# EAGLE design fpga_game_console (EAGLE 8.5.2)
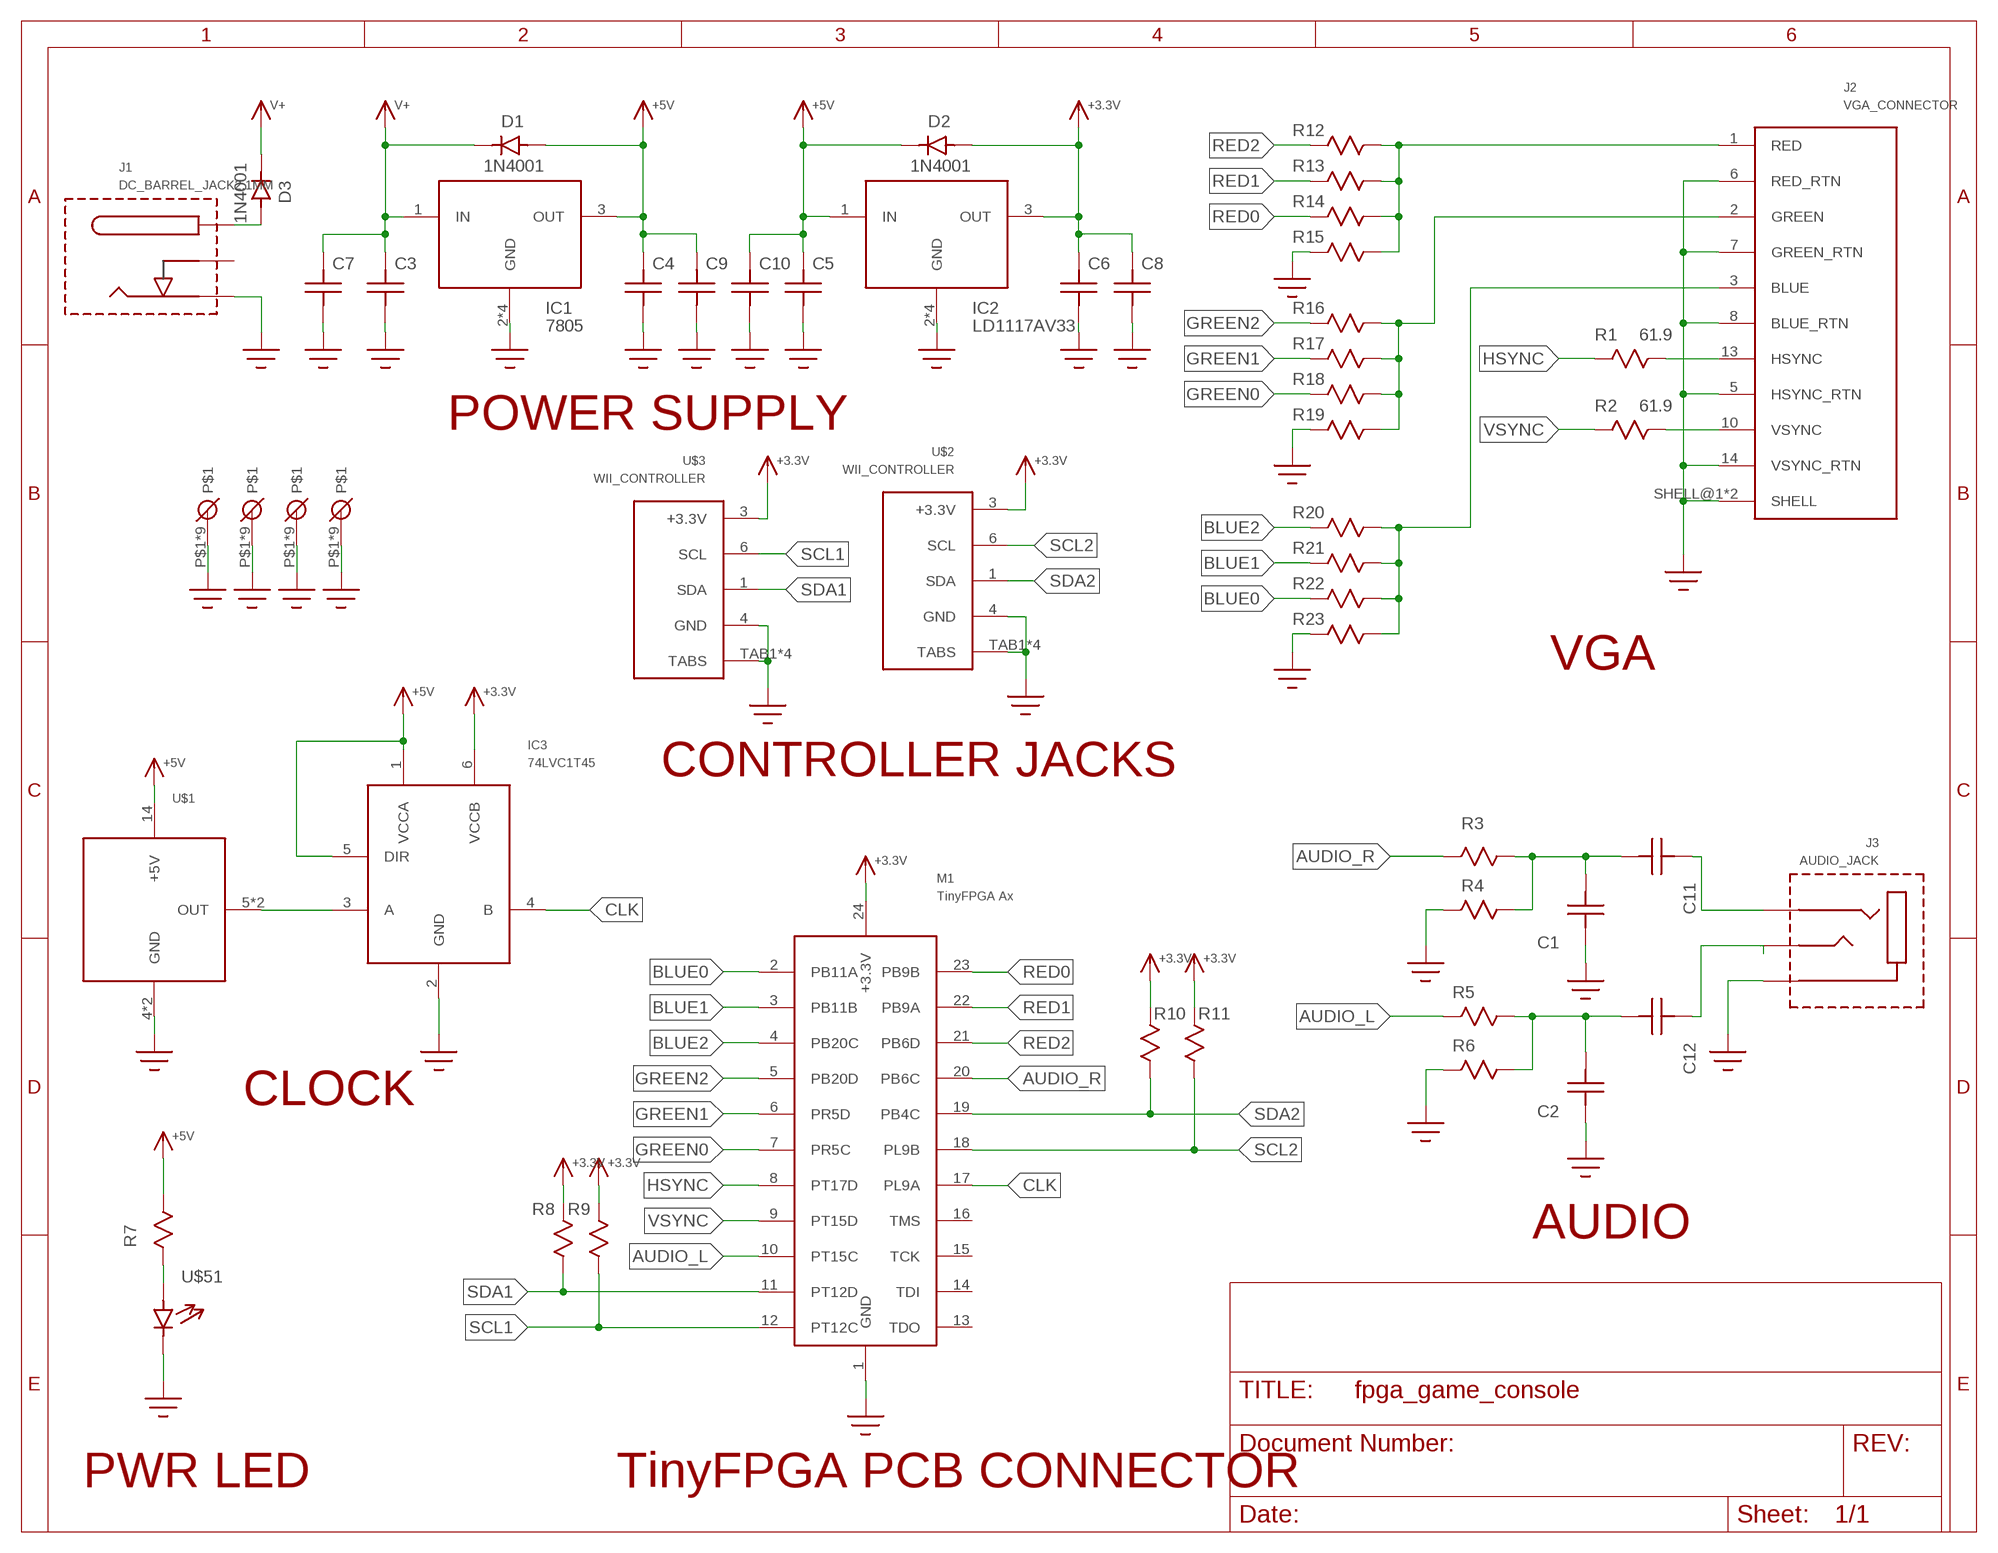
[diagram p0: schematic, sheet 1]

## Parts
C1  C  [C50X100]
C2  C  [C50X100]
C3  C  [C50X100]
C4  C  [C50X100]
C5  C  [C50X100]
C6  C  [C50X100]
C7  C  [C50X100]
C8  C  [C50X100]
C9  C  [C50X100]
C10  C  [C50X100]
C11  C  [C50X100]
C12  C  [C50X100]
D1  1N4001  D  [DO-41]
D2  1N4001  D  [DO-41]
D3  1N4001  D  [DO-41]
IC1  7805  78XX  [TO-220]
IC2  LD1117AV33  78XX  [TO-220]
IC3  74LVC1T45  [SOT23-6]
J1  DC_BARREL_JACK2.1MM  [2.1MM_BARREL]
J2  VGA_CONNECTOR  [VGA_CONNECTOR_FCI]
J3  AUDIO_JACK  [3.5MM_AUDIO_JACK]
M1  TinyFPGA Ax  TINYFPGA_A  [TINYFPGA_A]
R1  61.9  R  [R_0.25W]
R2  61.9  R  [R_0.25W]
R3  R  [R_0.25W]
R4  R  [R_0.25W]
R5  R  [R_0.25W]
R6  R  [R_0.25W]
R7  R  [R_0.25W]
R8  R  [R_0.25W]
R9  R  [R_0.25W]
R10  R  [R_0.25W]
R11  R  [R_0.25W]
R12  R  [R_0.25W]
R13  R  [R_0.25W]
R14  R  [R_0.25W]
R15  R  [R_0.25W]
R16  R  [R_0.25W]
R17  R  [R_0.25W]
R18  R  [R_0.25W]
R19  R  [R_0.25W]
R20  R  [R_0.25W]
R21  R  [R_0.25W]
R22  R  [R_0.25W]
R23  R  [R_0.25W]
U$1  DUAL_OSCILLATOR  [DUAL_OSC_CAN]
U$2  WII_CONTROLLER  [WII_CONNECTOR]
U$3  WII_CONTROLLER  [WII_CONNECTOR]
U$51  LED  [LED_5MM_RA]
U$55  MOUNTING_HOLE  [4-40_MOUNTING_HOLE_SMALL_OUTLINE]
U$56  MOUNTING_HOLE  [4-40_MOUNTING_HOLE_SMALL_OUTLINE]
U$57  MOUNTING_HOLE  [4-40_MOUNTING_HOLE_SMALL_OUTLINE]
U$58  MOUNTING_HOLE  [4-40_MOUNTING_HOLE_SMALL_OUTLINE]

## Nets
+3.3V: C6.P$2 C8.P$2 D2.A IC2.3(OUT) IC3.6(VCCB) M1.24(+3.3V) R8.P$2 R9.P$2 R10.P$2 R11.P$2 U$2.3(+3.3V) U$3.3(+3.3V)
+5V: C4.P$2 C5.P$2 C9.P$2 C10.P$2 D1.A D2.C IC1.3(OUT) IC2.1(IN) IC3.1(VCCA) IC3.5(DIR) R7.P$1 U$1.14(+5V)
AUDIO_L: M1.10(PT15C) R5.P$2
AUDIO_R: M1.20(PB6C) R3.P$2
BLUE0: M1.2(PB11A) R22.P$2
BLUE1: M1.3(PB11B) R21.P$2
BLUE2: M1.4(PB20C) R20.P$2
CLK: IC3.4(B) M1.17(PL9A)
GND: C1.P$2 C2.P$2 C3.P$1 C4.P$1 C5.P$1 C6.P$1 C7.P$1 C8.P$1 C9.P$1 C10.P$1 IC1.2(GND) IC1.HS@1(GND) IC1.HS@2(GND) IC1.HS@3(GND) IC2.2(GND) IC2.HS@1(GND) IC2.HS@2(GND) IC2.HS@3(GND) IC3.2(GND) J1.2 J2.5(HSYNC_RTN) J2.6(RED_RTN) J2.7(GREEN_RTN) J2.8(BLUE_RTN) J2.14(VSYNC_RTN) J2.SHELL@1(SHELL) J2.SHELL@2(SHELL) J3.1 M1.1(GND) R4.P$2 R6.P$2 R15.P$2 R19.P$2 R23.P$2 U$1.4(GND) U$1.7(GND) U$2.4(GND) U$2.TAB1(TABS) U$2.TAB2(TABS) U$2.TAB3(TABS) U$2.TAB4(TABS) U$3.4(GND) U$3.TAB1(TABS) U$3.TAB2(TABS) U$3.TAB3(TABS) U$3.TAB4(TABS) U$51.C U$55.P$1 U$55.P$2 U$55.P$3 U$55.P$4 U$55.P$5 U$55.P$6 U$55.P$7 U$55.P$8 U$55.P$9 U$56.P$1 U$56.P$2 U$56.P$3 U$56.P$4 U$56.P$5 U$56.P$6 U$56.P$7 U$56.P$8 U$56.P$9 U$57.P$1 U$57.P$2 U$57.P$3 U$57.P$4 U$57.P$5 U$57.P$6 U$57.P$7 U$57.P$8 U$57.P$9 U$58.P$1 U$58.P$2 U$58.P$3 U$58.P$4 U$58.P$5 U$58.P$6 U$58.P$7 U$58.P$8 U$58.P$9
GREEN0: M1.7(PR5C) R18.P$2
GREEN1: M1.6(PR5D) R17.P$2
GREEN2: M1.5(PB20D) R16.P$2
HSYNC: M1.8(PT17D) R1.P$1
N$1: D3.A J1.1
N$2: IC3.3(A) U$1.5(OUT) U$1.8(OUT)
N$3: J2.1(RED) R12.P$2 R13.P$2 R14.P$2 R15.P$1
N$4: J2.2(GREEN) R16.P$1 R17.P$1 R18.P$1 R19.P$1
N$5: J2.3(BLUE) R20.P$1 R21.P$1 R22.P$1 R23.P$1
N$6: C1.P$1 C11.P$1 R3.P$1 R4.P$1
N$7: C2.P$1 C12.P$1 R5.P$1 R6.P$1
N$8: R7.P$2 U$51.A
N$10: C12.P$2
N$11: C11.P$2 J3.3
N$18: J2.13(HSYNC) R1.P$2
N$19: J2.10(VSYNC) R2.P$2
RED0: M1.23(PB9B) R14.P$1
RED1: M1.22(PB9A) R13.P$1
RED2: M1.21(PB6D) R12.P$1
SCL1: M1.12(PT12C) R9.P$1 U$3.6(SCL)
SCL2: M1.18(PL9B) R11.P$1 U$2.6(SCL)
SDA1: M1.11(PT12D) R8.P$1 U$3.1(SDA)
SDA2: M1.19(PB4C) R10.P$1 U$2.1(SDA)
V+: C3.P$2 C7.P$2 D1.C D3.C IC1.1(IN)
VSYNC: M1.9(PT15D) R2.P$1
Unconnected: J1.3 J3.2 M1.13(TDO) M1.14(TDI) M1.15(TCK) M1.16(TMS)

## Notes on the sheet
- POWER SUPPLY
- VGA
- CONTROLLER JACKS
- CLOCK
- AUDIO
- PWR LED | TinyFPGA PCB CONNECTOR

## Library data of the parts
C1-C12 = fpga_game_console:C
D1-D3 = fpga_game_console:D
IC1 IC2 = fpga_game_console:78XX
IC3 = fpga_game_console:74LVC1T45
J1 = fpga_game_console:DC_BARREL_JACK
J2 = fpga_game_console:VGA_CONNECTOR
J3 = fpga_game_console:AUDIO_JACK
M1 = fpga_game_console:TINYFPGA_A
R1-R23 = fpga_game_console:R
U$1 = fpga_game_console:DUAL_OSCILLATOR
U$2 U$3 = fpga_game_console:WII_CONTROLLER
U$51 = fpga_game_console:LED
U$55-U$58 = fpga_game_console:MOUNTING_HOLE

## Board
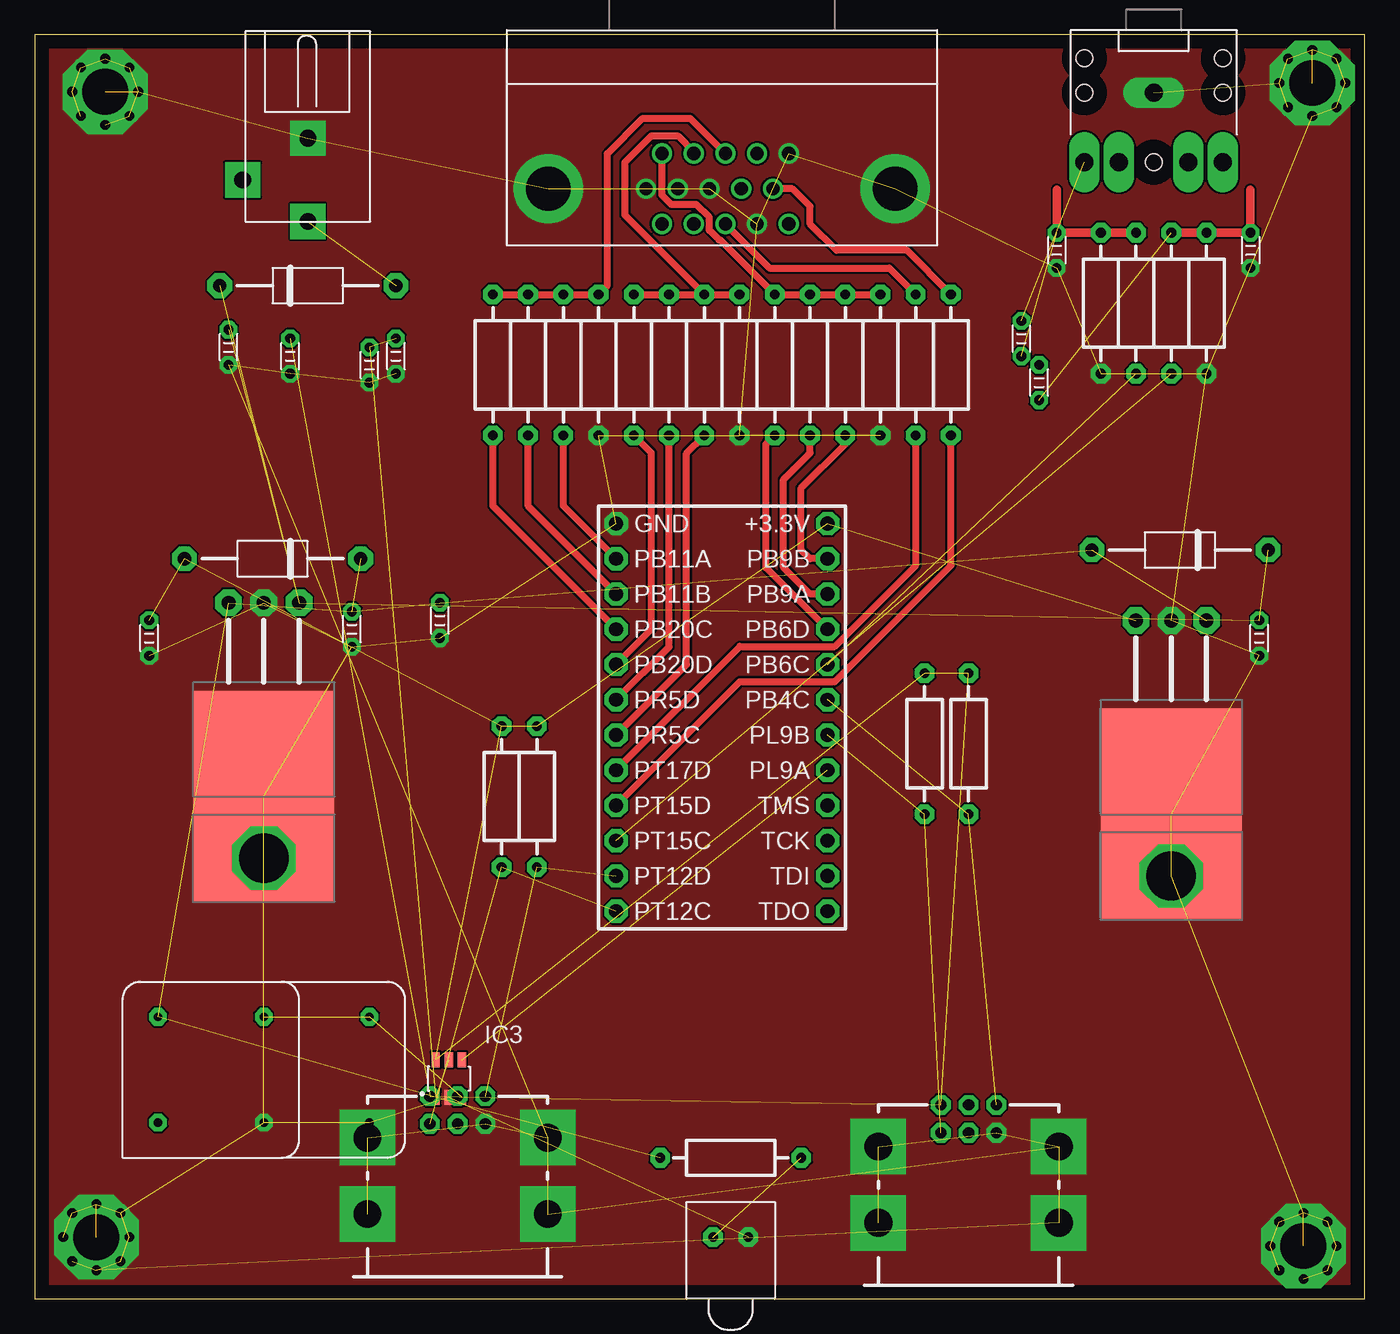
[diagram p1: board, top side]
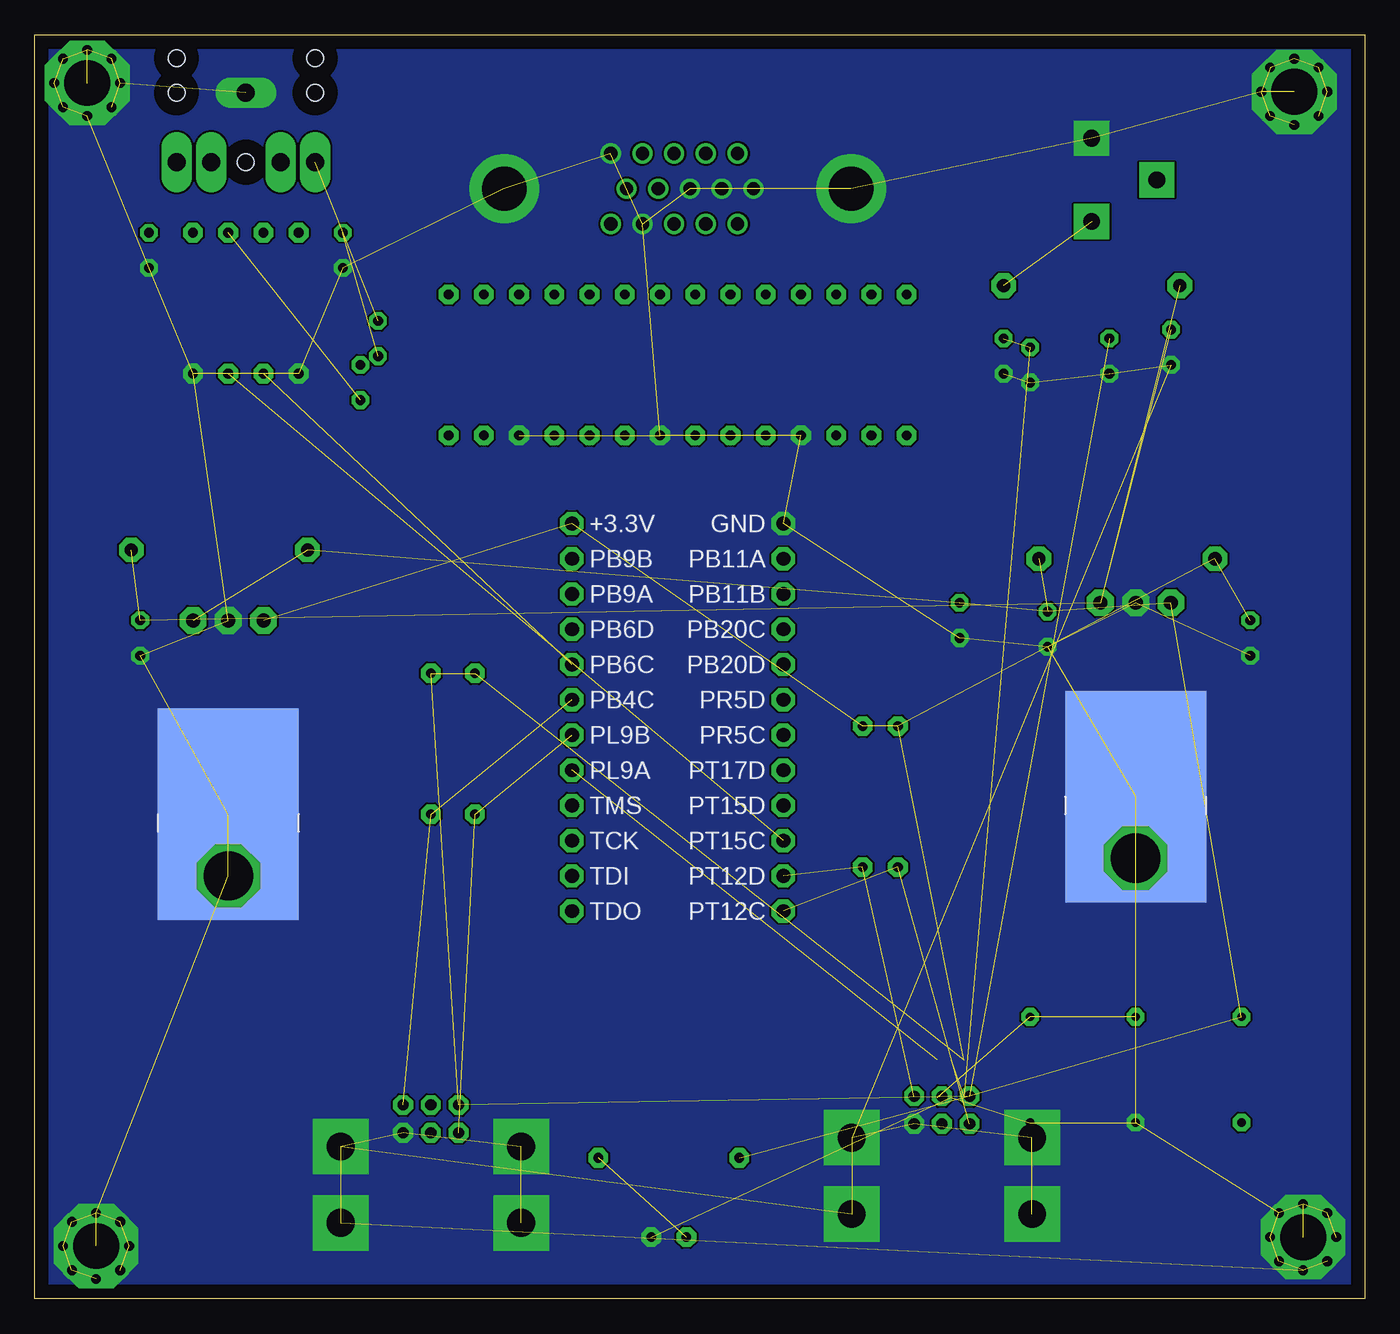
[diagram p2: board, bottom side, seen from below]

Size 95.86 x 91.11 mm. Coordinates in mm from the lower left corner, seen from the top.
Outline: 0,0 95.86,0 95.86,91.11 0,91.11 0,0
Copper layers (1*16): Top 0.035mm / dielectric 1.5mm / Bottom 0.035mm
Design rules "default": minimum track width 6mil, minimum drill 0.35mm, track to track 6mil, track to pad 6mil, pad to pad 6mil, via to via 6mil, smd to smd 6mil, copper to edge 40mil, drill to drill 6mil, minimum pad ring 10mil, minimum via ring 8mil, stop-mask expansion 4mil, vias tented up to drill 0mil, thermal gap 10mil

### Footprints (pad centres in the part's own frame; a part is rotated, then mirrored left to right if it is on the bottom)
C50X100 = drill 0.7 pad 1.27 octagon: P$1 -1.27,0; P$2 1.27,0
DO-41 = drill 0.95 pad 1.778 octagon: A -6.35,0; C 6.35,0
TO-220 = drill 1 pad 1.93 octagon: 1 -2.54,-18.415; 2 0,-18.415; 3 2.54,-18.415 | drill 3.556 octagon: HS@1 0,0 | smd 10.16 x 15.24: HS@2 0,-4.445 | smd 10.16 x 15.24 bottom: HS@3 0,-4.445
SOT23-6 = smd 0.6 x 1.1: 1 -0.95,-1.35; 2 0,-1.35; 3 0.95,-1.35; 4 0.95,1.35; 5 0,1.35; 6 -0.95,1.35
2.1MM_BARREL = drill 1.2 pad 2.54 square: 1 0,-3; 2 0,3; 3 -4.7,0
VGA_CONNECTOR_FCI = drill 0.95: 1 -4.32,2.54; 2 -2.035,2.54; 3 0.25,2.54; 4 2.535,2.54; 5 4.82,2.54; 6 -5.463,0; 7 -3.178,0; 8 -0.892,0; 9 1.393,0; 10 3.678,0; 11 -4.32,-2.54; 12 -2.035,-2.54; 13 0.25,-2.54; 14 2.535,-2.54; 15 4.82,-2.54 | drill 3.2 pad 5: SHELL@1 -12.5,0; SHELL@2 12.5,0
3.5MM_AUDIO_JACK = drill 1.3 pad 2.184 long: 1 -5,0; 2 0,5; 3 0,-5; 10 0,2.5; 11 0,-2.5 | hole 1.2: -7.5,5; -5,-5; -5,5; -7.5,-5; 0,0
TINYFPGA_A = drill 1 pad 1.676 octagon: 1 -13.97,-7.62; 2 -11.43,-7.62; 3 -8.89,-7.62; 4 -6.35,-7.62; 5 -3.81,-7.62; 6 -1.27,-7.62; 7 1.27,-7.62; 8 3.81,-7.62; 9 6.35,-7.62; 10 8.89,-7.62; 11 11.43,-7.62; 12 13.97,-7.62; 13 13.97,7.62; 14 11.43,7.62; 15 8.89,7.62; 16 6.35,7.62; 17 3.81,7.62; 18 1.27,7.62; 19 -1.27,7.62; 20 -3.81,7.62; 21 -6.35,7.62; 22 -8.89,7.62; 23 -11.43,7.62; 24 -13.97,7.62
R_0.25W = drill 0.7 pad 1.422 octagon: P$1 -5.08,0; P$2 5.08,0
DUAL_OSC_CAN = drill 0.6 pad 1.27 octagon: 1 -7.62,-3.81; 4 0,-3.81; 5 0,3.81; 7 7.62,-3.81; 8 7.62,3.81; 14 -7.62,3.81
WII_CONNECTOR = drill 0.8 pad 1.422 octagon: 1 -2,0; 2 0,0; 3 2,0; 4 -2,2; 5 0,2; 6 2,2 | drill 2 pad 4 square: TAB1 -6.5,8.5; TAB2 -6.5,3; TAB3 6.5,8.5; TAB4 6.5,3
LED_5MM_RA = drill 0.7 pad 1.422 octagon: A -1.27,0; C 1.27,0
4-40_MOUNTING_HOLE_SMALL_OUTLINE = drill 3.302 pad 6.096 octagon: P$1 0,0 | drill 0.7 pad 1.016 octagon: P$2 0,2.381; P$3 0,-2.381; P$4 -2.381,0; P$5 2.381,0; P$6 1.746,1.746; P$7 -1.746,1.746; P$8 -1.746,-1.746; P$9 1.746,-1.746

### Placement (x,y rotation side)
C1  73.66,75.56 270 top
C2  87.63,75.56 270 top
C3  88.27,47.62 90 top
C4  22.86,48.26 90 top
C5  29.21,48.9 90 top
C6  8.26,47.62 90 top
C7  13.97,68.58 90 top
C8  18.41,67.94 90 top
C9  24.13,67.31 90 top
C10  26.04,67.94 90 top
C11  71.12,69.22 90 top
C12  72.39,66.04 90 top
D1  82.55,53.98 0 top
D2  17.14,53.34 0 top
D3  19.68,73.03 180 top
IC1  16.51,31.75 180 top
IC2  81.92,30.48 180 top
IC3  29.84,15.88 0 top
J1  19.68,80.64 0 top
J2  49.53,80.01 0 top
J3  80.64,81.92 270 top
M1  49.53,41.91 270 top
R1  63.5,67.31 90 top
R2  66.04,67.31 90 top
R3  79.38,71.75 270 top
R4  76.83,71.75 270 top
R5  81.92,71.75 270 top
R6  84.45,71.75 270 top
R7  50.16,10.16 0 top
R8  36.2,36.2 90 top
R9  33.66,36.2 90 top
R10  67.31,40.01 90 top
R11  64.14,40.01 90 top
R12  53.34,67.31 90 top
R13  55.88,67.31 90 top
R14  58.42,67.31 90 top
R15  60.96,67.31 270 top
R16  43.18,67.31 270 top
R17  45.72,67.31 270 top
R18  48.26,67.31 270 top
R19  50.8,67.31 270 top
R20  33.02,67.31 270 top
R21  35.56,67.31 270 top
R22  38.1,67.31 270 top
R23  40.64,67.31 270 top
U$1  16.51,16.51 0 top
U$2  67.31,13.97 180 top
U$3  30.48,14.61 180 top
U$51  50.16,4.45 0 top
U$55  4.45,4.45 0 top
U$56  5.08,87 0 top
U$57  92.08,87.63 0 top
U$58  91.44,3.81 0 top

### Tracks (layer width: path | path; a pad name or v marks a point on that pad's centre or on a via)
+3.3V  (11 unrouted)
+5V  (11 unrouted)
AUDIO_L  (1 unrouted)
AUDIO_R  (1 unrouted)
BLUE0
  Top 0.508: M1.2 38.1,57.15 R22.P$2
BLUE1
  Top 0.508: M1.3 35.56,57.15 R21.P$2
BLUE2
  Top 0.508: M1.4 33.02,57.15 R20.P$2
CLK  (1 unrouted)
GND  (82 unrouted)
  pour Top (no thermals): 0,0 95.89,0 95.89,90.81 0,90.81
  pour Bottom (no thermals): 0,0 95.89,0 95.89,90.81 0,90.81
GREEN0
  Top 0.508: M1.7 46.99,45.72 46.99,60.96 R18.P$2
GREEN1
  Top 0.508: M1.6 45.72,46.99 R17.P$2
GREEN2
  Top 0.508: M1.5 44.45,48.26 44.45,60.96 R16.P$2
HSYNC
  Top 0.508: M1.8 50.83,47.02 57.67,47.02 63.5,52.85 R1.P$1
N$1  (1 unrouted)
N$2  (2 unrouted)
N$3
  Top 0.508: R15.P$1 R14.P$2 R13.P$2 R12.P$2 49.4,76.33 49.31,76.33 48.63,77.01 48.63,77.94 47.7,78.88 45.88,78.88 45.21,79.55 J2.1
N$4
  Top 0.508: R16.P$1 R17.P$1 R18.P$1 | R18.P$1 R19.P$1 | R18.P$1 42.55,78.11 42.55,81.92 44.45,83.82 46.35,83.82 47.49,82.68 J2.2
N$5
  Top 0.508: R20.P$1 R21.P$1 R22.P$1 R23.P$1 41.27,73.03 41.27,82.55 43.81,85.09 47.24,85.09 J2.3
N$6  (1 unrouted)
  Top 0.61: R3.P$1 R4.P$1 C1.P$1 73.66,79.93
N$7  (1 unrouted)
  Top 0.61: R5.P$1 R6.P$1 C2.P$1 87.63,79.93
N$8  (1 unrouted)
N$11  (1 unrouted)
N$18
  Top 0.508: J2.13 52.95,74.3 61.59,74.3 R1.P$2
N$19
  Top 0.508: R2.P$2 62.87,75.56 57.78,75.56 55.88,77.47 55.88,78.74 54.61,80.01 J2.10
RED0
  Top 0.508: M1.23 55.88,53.34 55.24,53.98 55.24,58.42 58.42,61.59 R14.P$1
RED1
  Top 0.508: M1.22 55.88,50.8 53.98,52.7 53.98,59.05 55.88,60.96 R13.P$1
RED2
  Top 0.508: M1.21 52.7,52.7 52.7,61.59 R12.P$1
SCL1  (2 unrouted)
SCL2  (2 unrouted)
SDA1  (2 unrouted)
SDA2  (2 unrouted)
V+  (4 unrouted)
VSYNC
  Top 0.508: M1.9 50.83,44.48 57.67,44.48 66.04,52.85 R2.P$1